# EAGLE design ESP12_Receipt_Printer (EAGLE 9.6.2)
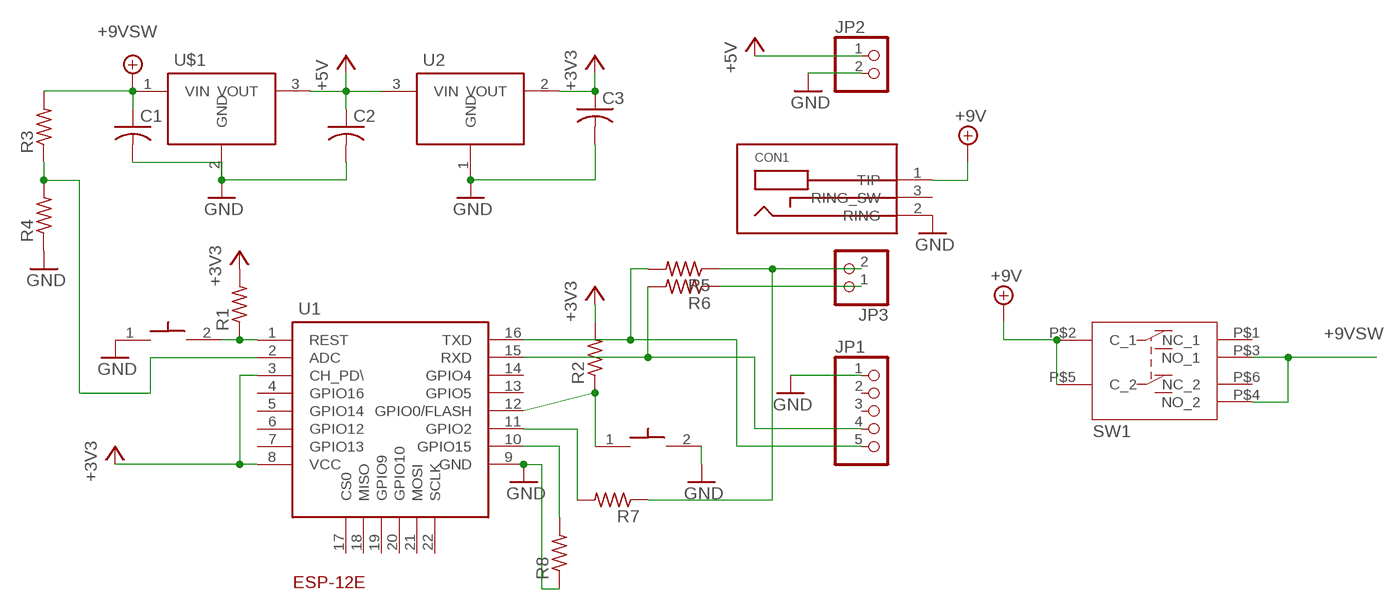
[diagram p0: schematic, sheet 1]

## Parts
BTN1  FSMSM_SWITCH_6X3.6  [SMD-2-SWITCH]
BTN2  FSMSM_SWITCH_6X3.6  [SMD-2-SWITCH]
C1  C-USC0805  [C0805]
C2  C-USC0805  [C0805]
C3  C-USC0805  [C0805]
CON1  BARREL_JACK_3PINPJ-102A_2MM_HOLES  [PJ-102A_2MM_HOLES]
JP1  PINHD-1X5/90  [1X05/90]
JP2  PINHD-1X2/90  [1X02/90]
JP3  PINHD-1X2/90  [1X02/90]
R1  R-US_M0805  [M0805]
R2  R-US_M0805  [M0805]
R3  R-US_M0805  [M0805]
R4  R-US_M0805  [M0805]
R5  R-US_M0805  [M0805]
R6  R-US_M0805  [M0805]
R7  R-US_M0805  [M0805]
R8  R-US_M0805  [M0805]
SW1  SW_TOGGLE_6PIN_DPDT  [BTN_6PIN]
U1  ESP-12E  [ESP-12E]
U2  AMS1117  [SOT223]
U$1  7805  [TO252-3]

## Nets
+3V3: C3.1 R1.2 R2.2 U1.3(CH_PD\) U1.8(VCC) U2.2(VOUT)
+5V: C2.1 JP2.1 U2.3(VIN) U$1.3(VOUT)
+9V_SW: CON1.1(TIP) SW1.P$2(C_1) SW1.P$5(C_2) ; supply symbol labelled +9V
+9VSW: C1.1 R3.2 SW1.P$3(NO_1) SW1.P$4(NO_2) U$1.1(VIN) ; supply symbol labelled +9V
GND: BTN1.2 BTN2.1 C1.2 C2.2 C3.2 CON1.2(RING) JP1.1 JP2.2 R4.1 R8.1 U1.9(GND) U2.1(GND) U$1.2(GND)
N$1: BTN1.1 R2.1 U1.12(GPIO0/FLASH)
N$2: BTN2.2 R1.1 U1.1(REST)
N$3: JP1.4 R6.2 U1.15(RXD)
N$4: JP1.5 R5.2 U1.16(TXD)
N$5: R3.1 R4.2 U1.2(ADC)
N$6: JP3.1 R6.1
N$7: R8.2 U1.10(GPIO15)
N$8: R7.2 U1.11(GPIO2)
N$9: JP3.2 R5.1 R7.1
Unconnected: CON1.3(RING_SW) JP1.2 JP1.3 SW1.P$1(NC_1) SW1.P$6(NC_2) U1.4(GPIO16) U1.5(GPIO14) U1.6(GPIO12) U1.7(GPIO13) U1.13(GPIO5) U1.14(GPIO4) U1.17(CS0) U1.18(MISO) U1.19(GPIO9) U1.20(GPIO10) U1.21(MOSI) U1.22(SCLK)

## Library data of the parts
BTN1 BTN2 = DR:FSMSM_SWITCH_6X3.6: SMD SWITCH - Single Contact
C1-C3 = DR:C-US: CAPACITOR, American symbol
CON1 = DR:BARREL_JACK_3PIN
JP1 = pinhead:PINHD-1X5: PIN HEADER
JP2 JP3 = pinhead:PINHD-1X2: PIN HEADER
R1-R8 = DR:R-US_: RESISTOR, American symbol
SW1 = DR:SW_TOGGLE_6PIN_DPDT
U1 = DR:ESP-12E
U2 = DR:AMS1117: Voltage Regulator 1A
U$1 = DR:7805

## Board
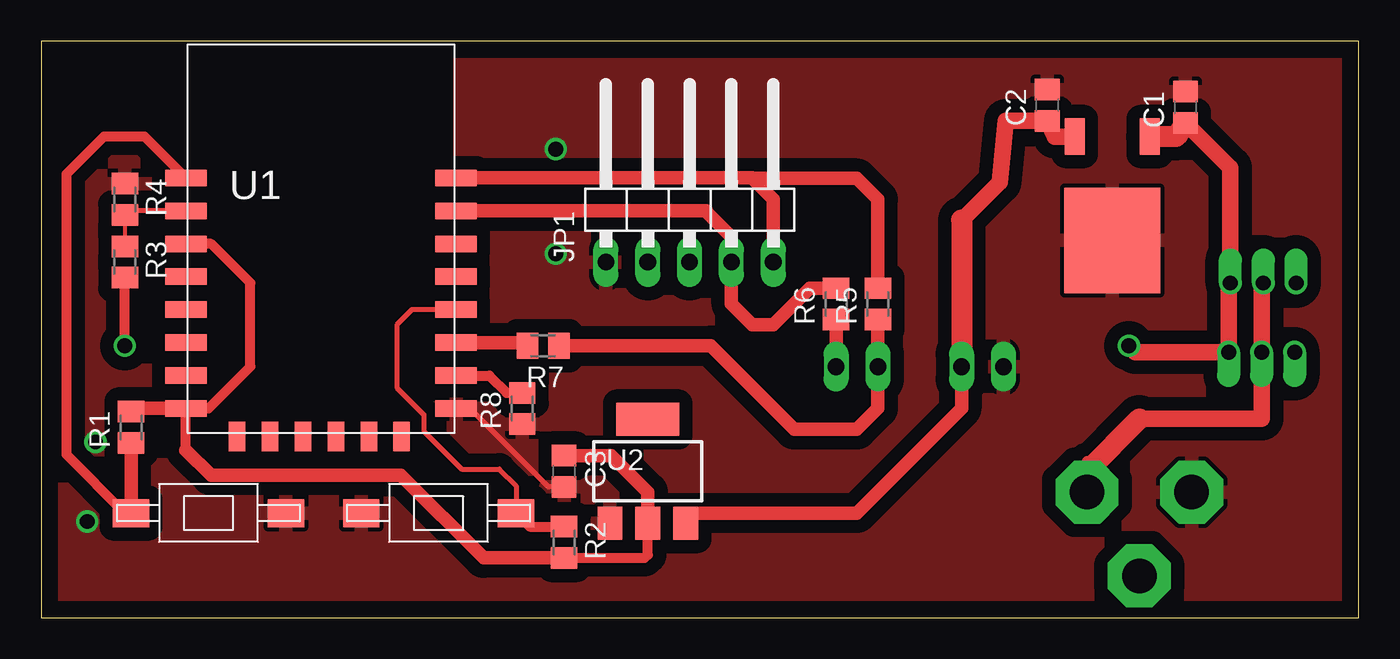
[diagram p1: board, top side]
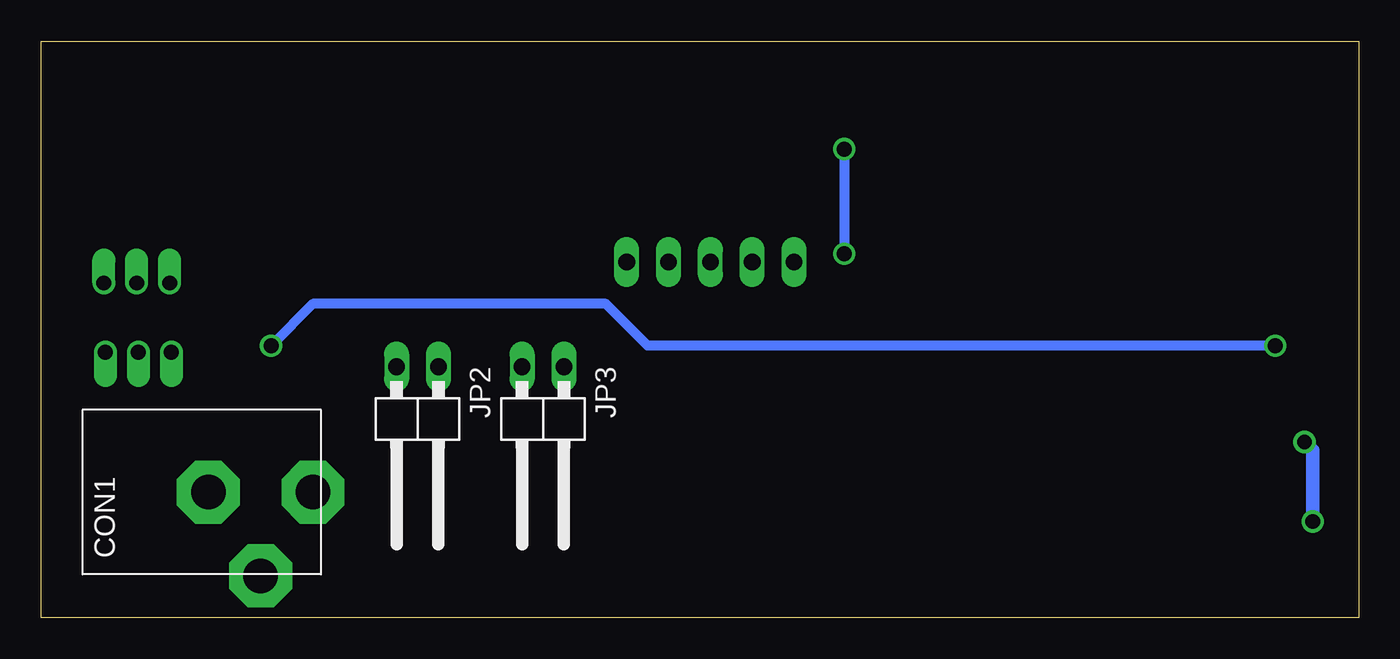
[diagram p2: board, bottom side, seen from below]

Size 80 x 35 mm. Coordinates in mm from the lower left corner, seen from the top.
Outline: 0,0 80,0 80,35 0,35 0,0
Copper layers (1*16): Top 0.035mm / dielectric 1.5mm / Bottom 0.035mm
Design rules "default": minimum track width 6mil, minimum drill 0.35mm, track to track 6mil, track to pad 6mil, pad to pad 6mil, via to via 6mil, smd to smd 6mil, copper to edge 40mil, drill to drill 6mil, minimum pad ring 10mil, minimum via ring 8mil, stop-mask expansion 4mil, vias tented up to drill 0mil, thermal gap 10mil

### Footprints (pad centres in the part's own frame; a part is rotated, then mirrored left to right if it is on the bottom)
SMD-2-SWITCH = smd 2.2 x 1.7: 1 -4.7,0; 2 4.7,0
C0805 = smd 1.3 x 1.5: 1 -0.95,0; 2 0.95,0
PJ-102A_2MM_HOLES = drill 2.1 pad 3.81 octagon: 1 0,0; 2 0,6.35; 3 -5.08,3.175
1X05/90 = drill 1.016 long: 1 -5.08,-3.81; 2 -2.54,-3.81; 3 0,-3.81; 4 2.54,-3.81; 5 5.08,-3.81
1X02/90 = drill 1.016 long: 1 -1.27,-3.81; 2 1.27,-3.81
M0805 = smd 1.3 x 1.6: 1 -0.95,0; 2 0.95,0
BTN_6PIN = drill 0.9 pad 1.27 offset: P$1 0,0; P$2 2,0; P$3 4,0; P$4 4.1,4.2; P$5 2.1,4.2; P$6 0.1,4.2
ESP-12E = smd 2.5 x 1: 1 -0.1,14; 2 -0.1,12; 3 -0.1,10; 4 -0.1,8; 5 -0.1,6; 6 -0.1,4; 7 -0.1,2; 8 -0.1,0; 9 16.3,0; 10 16.3,2; 11 16.3,4; 12 16.3,6; 13 16.3,8; 14 16.3,10; 15 16.3,12; 16 16.3,14 | smd 1 x 1.8: 17 3,-1.7; 18 5,-1.7; 19 7,-1.7; 20 9,-1.7; 21 11,-1.7; 22 13,-1.7
SOT223 = smd 1.5 x 2: 1 -2.3,-3.15; 2 0,-3.15; 3 2.3,-3.15 | smd 3.8 x 2: 4 0,3.15
TO252-3 = smd 1.2 x 2.2: 1 0,0; 3 4.56,0 | smd 5.8 x 6.4: 2 2.28,6.3

### Placement (x,y rotation side)
BTN1  24.13,6.35 180 top
BTN2  10.16,6.35 180 top
C1  69.47,30.99 90 top
C2  61.09,31.11 90 top
C3  31.75,8.89 270 top
CON1  63.5,7.62 90 bottom
JP1  39.37,25.4 0 top
JP2  57.15,11.43 180 bottom
JP3  49.53,11.43 180 bottom
R1  5.46,11.56 90 top
R2  31.75,4.57 270 top
R3  5.08,21.59 270 top
R4  5.08,25.4 270 top
R5  50.8,19.05 90 top
R6  48.26,19.05 90 top
R7  30.48,16.51 180 top
R8  29.21,12.7 90 top
SW1  76.2,20.32 180 top
U1  8.89,12.7 0 top
U2  36.83,8.89 0 top
U$1  67.31,29.21 180 top

### Tracks (layer width: path | path; a pad name or v marks a point on that pad's centre or on a via)
+3V3
  Top 0.61: R2.2 36.64,3.62 36.83,3.81 U2.2 | 8.79,10.16 U1.8 10.16,12.7 12.7,15.24 12.7,20.32 10.32,22.7 U1.3
  Top 0.813: U2.2 36.83,7.62 34.61,9.84 C3.1 | R2.2 26.86,3.62 21.84,8.64 10.31,8.64 8.79,10.16 | U1.8 5.08,12.7 5.27,12.51 R1.2
+5V
  Top 0.813: U2.3 39.37,5.5 39.37,6.35 49.53,6.35 55.88,12.7 JP2.1
  Top 1.016: U$1.3 61.55,29.21 C2.1 58.57,30.16 58.2,26.45 55.88,24.13
  Top 1.27: 55.88,24.13 JP2.1
+9V_SW
  Top 0.61: 63.5,9.53 CON1.1
  Top 1.016: 66.67,12.06 74.1,12.06 SW1.P$5 74.1,20.22 SW1.P$2
  Top 1.27: CON1.1 63.5,8.89 66.67,12.06
+9VSW  (via drill 0.9 pad 1.3)
  Top 0.61: v5.08,16.51 R3.2
  Top 1.016: C1.1 72.2,27.31 SW1.P$3 72.1,20.22 SW1.P$4 66.43,16.12 v66.04,16.51
  Top 1.27: C1.1 68.9,29.21 U$1.1
  Bottom 0.61: v5.08,16.51 43.18,16.51 45.72,19.05 63.5,19.05 v66.04,16.51
GND  (via drill 0.9 pad 1.3)
  Top 0.305: C3.2 30.8,7.94 26.04,12.7 U1.9
  Bottom 0.61: v31.24,28.45 v31.24,22.1
  Bottom 0.813: v2.79,5.84 2.79,10.16 v3.3,10.67
  pour Top (isolate 0.813): -1.27,35 9.31,35 9.31,28.28 9.4,28.19 21.59,27.94 25.4,27.94 25.4,35.56 81.28,35.56 81.28,-1.27 -1.27,-1.27
N$1
  Top 0.305: U1.12 22.51,18.7 21.59,17.78 21.59,13.97 23.24,12.32 23.24,11.3 25.53,9.02 27.81,9.02 28.83,8 BTN1.1
  Top 0.61: BTN1.1 29.66,5.52 R2.1
N$2
  Top 0.61: U1.1 6.28,29.21 3.81,29.21 1.52,26.92 1.52,9.91 5.08,6.35 BTN2.2
  Top 0.813: BTN2.2 R1.1
N$3
  Top 0.813: U1.15 40.39,24.7 40.39,24.64 41.91,23.11 JP1.4 41.91,19.05 43.18,17.78 44.45,17.78 46.67,20 R6.2
N$4
  Top 0.813: U1.16 43.18,26.7 43.18,26.67 | JP1.5 44.45,25.4 43.18,26.67 | R5.2 50.8,25.4 49.53,26.67 43.18,26.67
N$5
  Top 0.254: 5.08,24.51 R4.2 5.08,24.13 R3.1 | 8.19,24.7 U1.2
  Top 0.305: U1.2 5.65,24.7 5.08,24.13
N$6
  Top 0.813: JP3.1 R6.1
N$7
  Top 0.61: U1.10 27.21,14.7 28.26,13.65 R8.2
N$8
  Top 0.813: U1.11 29.34,16.7 R7.2
N$9
  Top 0.813: R7.1 40.64,16.51 45.72,11.43 49.53,11.43 50.8,12.7 JP3.2 R5.1